# Altium schematic sheet Power.SchDoc
size A4; SheetNumber: 3; SheetTotal: 5
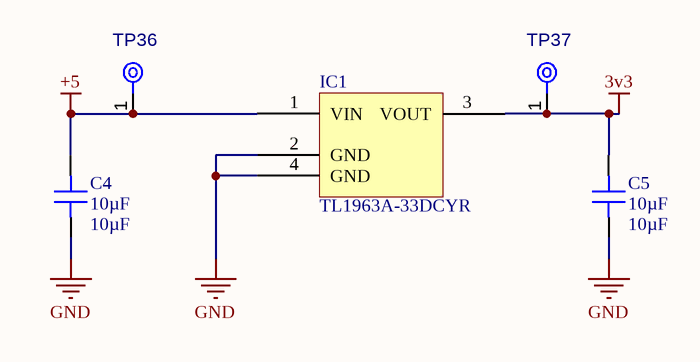
[diagram p0: Power.SchDoc]

## Parts
C4  10µF  [CAP 0805_2012]
C5  10µF  [CAP 0805_2012]
IC1  TL1963A-33DCYR  [TI SOT-223 DCY]
TP36  TPAD1.0R  [TP06R]  (value not drawn)  (no BOM)
TP37  TPAD1.0R  [TP06R]  (value not drawn)  (no BOM)

## Nets
3v3: C5.2 IC1.3(VOUT) TP37.1(TP)
+5: C4.2 IC1.1(VIN) TP36.1(TP)
GND: C4.1 C5.1 IC1.2(GND) IC1.4(GND)

## Library data of the parts
C4 C5 = 0805ZD106KAT4A: CAP CER 10UF 10V X5R 0805; Part Number: 0805ZD106KAT4A; Value: 10µF
IC1 = TL1963A-33DCYR: IC REG LINEAR 3.3V 1.5A SOT223-4; Manufacturer: Texas Instruments; Control Features: Enable; Current - Quiescent (Iq): 1mA; Current - Supply (Max): 80mA; Number of Regulators: 1; Output Configuration: Positive; Output Type: Fixed; Protection Features: Over Temperature, Reverse Polarity; PSRR: 63dB (120Hz); Voltage Dropout (Max): 0.55V @ 1.5A; Voltage - Input (Max): 20V; Part Number: TL1963A-33DCYR; ComponentLink1Description: Datasheet; ComponentLink1URL: http://www.ti.com/general/docs/suppproductinfo.tsp?distId=10&gotoUrl=http%3A%2F%2Fwww.ti.com%2Flit%2Fgpn%2Ftl1963a; ComponentLink2Description: DigiKey Link; ComponentLink2URL: http://digikey.com/product-detail/en/texas-instruments/TL1963A-33DCYR/296-24897-1-ND/2118661; Current - Output: 1.5A; LastUpdated: 19/09/2022 2:06:57 PM; Lifecycle Status: Active; Minimum Order: 1; Mounting Type: Surface Mount; Operating Temperature: -40°C ~ 125°C; Package / Case: TO-261-4, TO-261AA; Packaging: TapeAndReel; Part Status: Active; Price: 1.26; Series: -; Supplier 1: DigiKey; Supplier Part Number 1: 296-24897-1-ND; Supplier Device Package: SOT-223-4; Voltage - Output (Min/Fixed): 3.3V
TP36 TP37 = CMP-00028-00010-1: 1.0mm round testpoint; Pins: 1